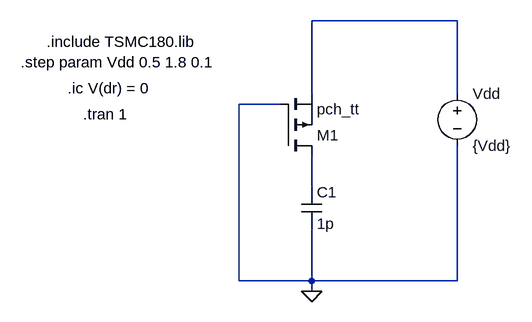
[diagram p0: schematic q1bp.asc]
q1bp.asc, the LTspice schematic file:
Version 4
SHEET 1 880 680
WIRE 432 -80 208 -80
WIRE 208 32 208 -80
WIRE 432 32 432 -80
WIRE 160 48 96 48
WIRE 208 176 208 128
WIRE 96 320 96 48
WIRE 208 320 208 240
WIRE 208 320 96 320
WIRE 432 320 432 112
WIRE 432 320 208 320
WIRE 208 336 208 320
FLAG 208 336 0
SYMBOL pmos 160 128 M180
SYMATTR InstName M1
SYMATTR Value pch_tt
SYMATTR Value2 W=240n L=180n
SYMBOL cap 192 176 R0
SYMATTR InstName C1
SYMATTR Value 1p
SYMBOL voltage 432 16 R0
SYMATTR InstName Vdd
SYMATTR Value {Vdd}
TEXT -200 -48 Left 2 !.include TSMC180.lib
TEXT -240 -16 Left 2 !.step param Vdd 0.5 1.8 0.1
TEXT -168 24 Left 2 !.ic V(dr) = 0
TEXT -144 64 Left 2 !.tran 1

The netlist it stands for:
* q1bp.asc
M1 N002 0 N001 N001 pch_tt W=240n L=180n
C1 N002 0 1p
Vdd N001 0 {Vdd}
.model NMOS NMOS
.model PMOS PMOS
.lib standard.mos
.include TSMC180.lib
.step param Vdd 0.5 1.8 0.1
.ic V(dr) = 0
.tran 1
.backanno
.end